# Altium schematic sheet CAN.SchDoc
size A4
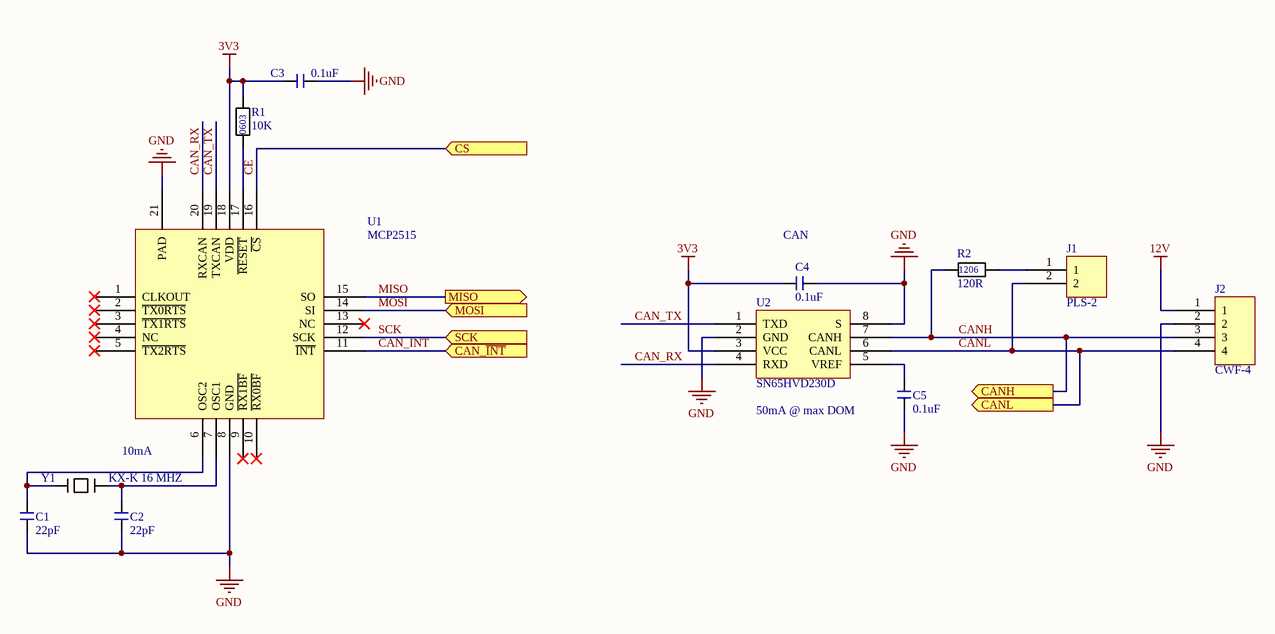
[diagram p0: CAN.SchDoc]

## Parts
C1  22pF  [CHIP_C_0603]
C2  22pF  [CHIP_C_0603]
C3  0.1uF  [CHIP_C_0603]
C4  0.1uF  [CHIP_C_0603]
C5  0.1uF  [CHIP_C_0603]
J1  PLS-2  [PLS-2]
J2  CWF-4  [CWF-4]
R1  10K  [CHIP_R_0603]
R2  120R  [CHIP_R_1206]
U1  MCP2515  [QFN20]
U2  SN65HVD230D  [SOIC8]
Y1  KX-K 16 MHZ  [CHIP_CRYSTAL_5032]

## Ports
CAN_~{INT} (in), CANH (out), CANL (out), CS (in), MISO (out), MOSI (in), SCK (in)

## Nets
3V3: C3.2 C4.2 R1.2 U1.18(VDD) U2.3(VCC)
12V: J2.1
GND: C1.1 C2.1 C3.1 C4.1 C5.1 J2.2 U1.8(GND) U1.21(PAD) U2.2(GND) U2.8(S)
CAN_~{INT}: U1.11(~{INT}) ; port CAN_~{INT}
CAN_RX: U1.20(RXCAN) U2.4(RXD)
CAN_TX: U1.19(TXCAN) U2.1(TXD)
CANH: J2.3 R2.1 U2.7(CANH) ; port CANH
CANL: J1.2 J2.4 U2.6(CANL) ; port CANL
CE: U1.16(~{CS}) ; port CS
MISO: U1.15(SO) ; port MISO
MOSI: U1.14(SI) ; port MOSI
SCK: U1.12(SCK) ; port SCK
NetC1_2: C1.2 U1.6(OSC2) Y1.1
NetC2_2: C2.2 U1.7(OSC1) Y1.2
NetC5_2: C5.2 U2.5(VREF)
NetJ1_1: J1.1 R2.2
NetR1_1: R1.1 U1.17(~{RESET})

Not connected (* = marked no-connect by the designer): U1 1(CLKOUT)* 2(~{TX0RTS})* 3(~{TX1RTS})* 4(NC)* 5(~{TX2RTS})* 9(~{RX1BF})* 10(~{RX0BF})* 13(NC)*

## Notes on the sheet
- (near C4) CAN
- 10mA
- 50mA @ max DOM
- (in symbol RES_0603) 0603
- (in symbol RES_1206) 1206

## Library data of the parts
C1-C5 = CHIP_C
J1 = PLS-2: Connector
R1 = RES_0603
R2 = RES_1206
U1 = MCP2515_QFN
U2 = TJA1050
Y1 = Quartz